# Altium project ALU_XOR_ONES.PrjPcb
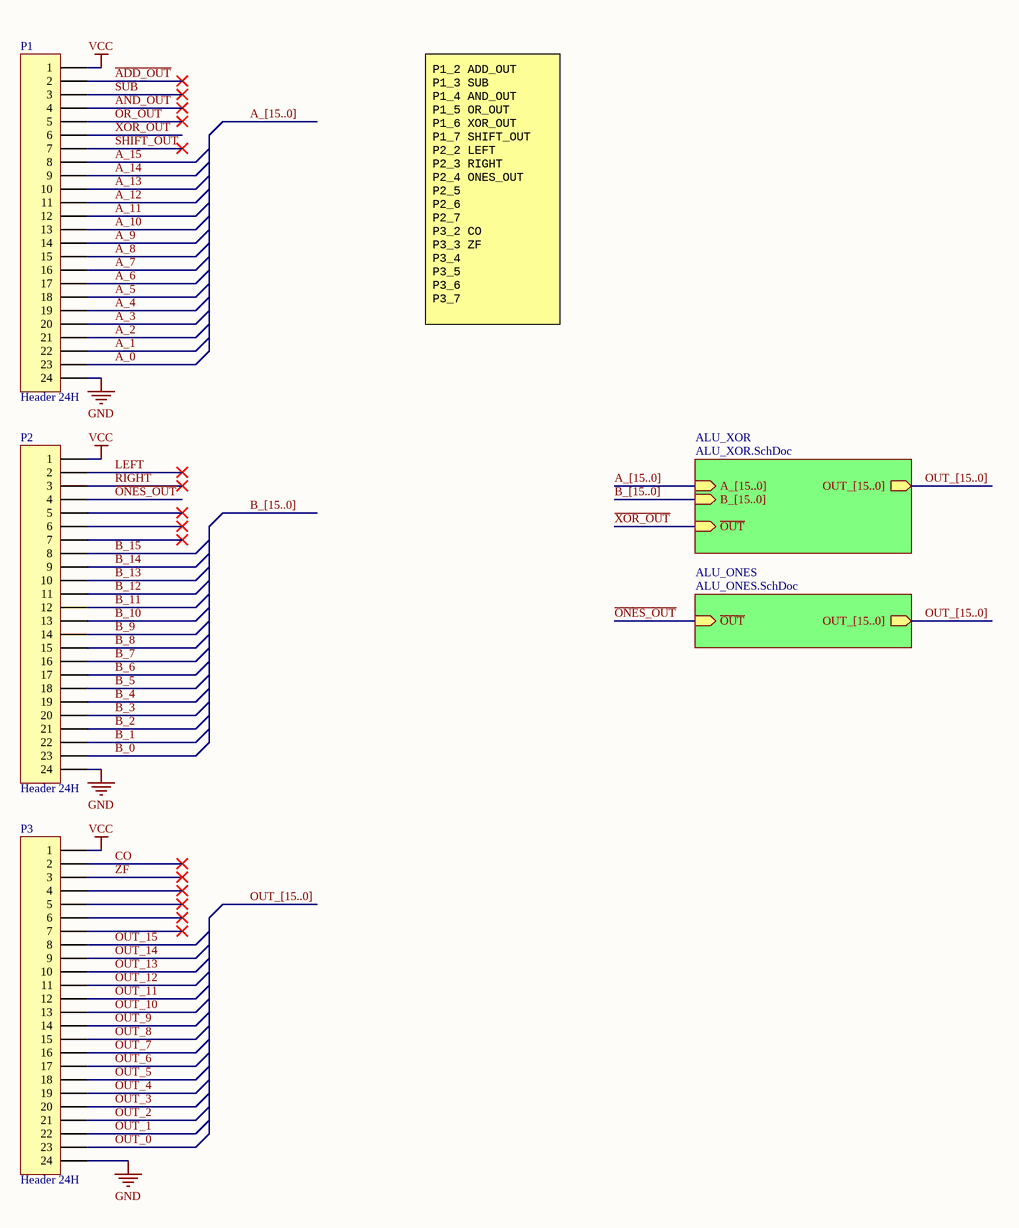
[diagram p0: Connectors.SchDoc]
3 sheets, 11 parts. Net scope: hierarchical (ports join the sheet entries above them; power ports are global).
Board file: ALU_XOR_ONES.PcbDoc
Sheets:
  Connectors.SchDoc
    ALU_XOR = ALU_XOR.SchDoc
    ALU_ONES = ALU_ONES.SchDoc

## Sheet Connectors.SchDoc
size B; Author: E. Sims; Organization: Let's Build Rockets Inc.; SheetNumber: 1; SheetTotal: 3

### Parts
P1  Header 24H  [HDR1X24H]
P2  Header 24H  [HDR1X24H]
P3  Header 24H  [HDR1X24H]

### Sub-sheets
ALU_ONES = ALU_ONES.SchDoc: ~{OUT} (in), OUT_[15..0] (out)
ALU_XOR = ALU_XOR.SchDoc: B_[15..0] (in), ~{OUT} (in), OUT_[15..0] (out), A_[15..0] (in)

### Nets
GND: P1.24 P2.24 P3.24
VCC: P1.1 P2.1 P3.1
~{ADD_OUT}: P1.2
~{AND_OUT}: P1.4
A_0: P1.23
A_1: P1.22
A_2: P1.21
A_3: P1.20
A_4: P1.19
A_5: P1.18
A_6: P1.17
A_7: P1.16
A_8: P1.15
A_9: P1.14
A_10: P1.13
A_11: P1.12
A_12: P1.11
A_13: P1.10
A_14: P1.9
A_15: P1.8
B_0: P2.23
B_1: P2.22
B_2: P2.21
B_3: P2.20
B_4: P2.19
B_5: P2.18
B_6: P2.17
B_7: P2.16
B_8: P2.15
B_9: P2.14
B_10: P2.13
B_11: P2.12
B_12: P2.11
B_13: P2.10
B_14: P2.9
B_15: P2.8
CO: P3.2
LEFT: P2.2
~{ONES_OUT}: P2.4 ; sheet ALU_ONES/~{OUT}
~{OR_OUT}: P1.5
OUT_0: P3.23
OUT_1: P3.22
OUT_2: P3.21
OUT_3: P3.20
OUT_4: P3.19
OUT_5: P3.18
OUT_6: P3.17
OUT_7: P3.16
OUT_8: P3.15
OUT_9: P3.14
OUT_10: P3.13
OUT_11: P3.12
OUT_12: P3.11
OUT_13: P3.10
OUT_14: P3.9
OUT_15: P3.8
RIGHT: P2.3
~{SHIFT_OUT}: P1.7
SUB: P1.3
~{XOR_OUT}: P1.6 ; sheet ALU_XOR/~{OUT}  [project net ~{OUT}]
~{ZF}: P3.3

Not connected (* = marked no-connect by the designer): P2 5* 6* 7*; P3 4* 5* 6* 7*

### Buses and harness runs
bus A_[15..0]
bus A_[15..0] = sheet ALU_XOR/A_[15..0]
bus B_[15..0]
bus B_[15..0] = sheet ALU_XOR/B_[15..0]
bus OUT_[15..0]
bus OUT_[15..0] = sheet ALU_ONES/OUT_[15..0]
bus OUT_[15..0] = sheet ALU_XOR/OUT_[15..0]

### Notes on the sheet
- P1_2 ADD_OUT
  P1_3 SUB
  P1_4 AND_OUT
  P1_5 OR_OUT
  P1_6 XOR_OUT
  P1_7 SHIFT_OUT
  P2_2 LEFT
  P2_3 RIGHT
  P2_4 ONES_OUT
  P2_5
  P2_6
  P2_7
  P3_2 CO
  P3_3 ZF
  P3_4
  P3_5
  P3_6
  P3_7
- Let's Build Rocket's Inc. Modular Paylaod System Based on TMP-010 Rev
  For more information visit https://github.com/LetsBuildRockets/Modular-Payload-System
  This work is licensed under CC BY-NC 4.0. To view a copy of this license, visit https://creativecommons.org/licenses/by-nc/4.0
- Title
- Size:
- Date:
- Assembly Variant:
- B
- Number:
- Time:
- Revision:
- Sheet
- of
- Author:
- File:

### Library data of the parts
P1-P3 = Header 24H: Header, 24-Pin, Right Angle; LatestRevisionDate: 17-Jul-2002; LatestRevisionNote: Re-released for DXP Platform.; Publisher: Altium Limited

## Sheet ALU_XOR.SchDoc
size B; Author: E. Sims; Organization: Let's Build Rockets Inc.; SheetNumber: 14; SheetTotal: 16
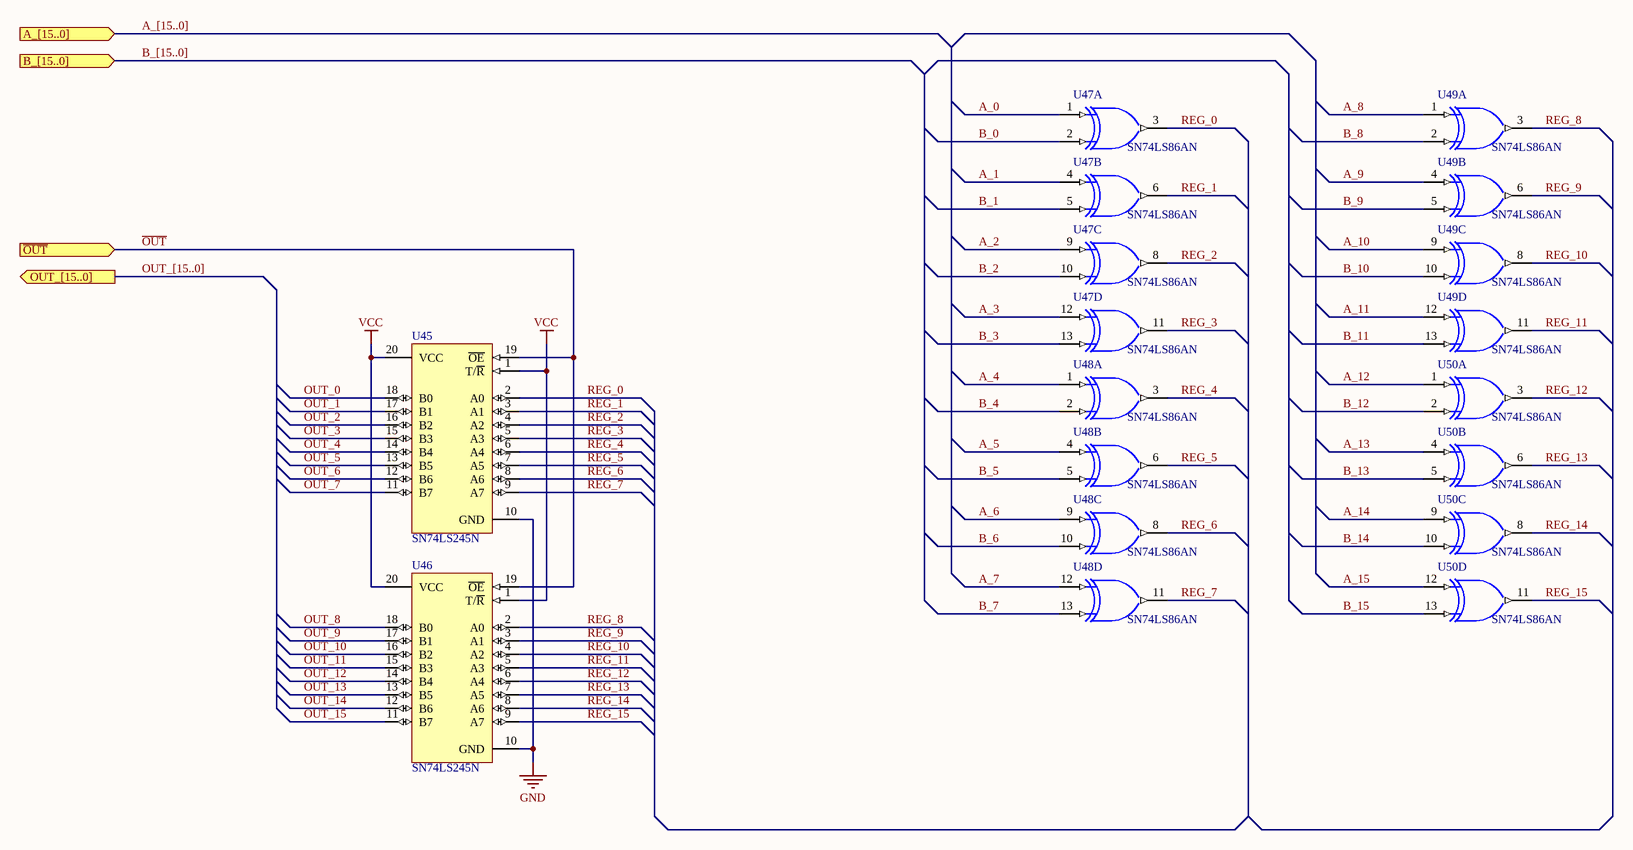
[diagram p1: ALU_XOR.SchDoc]

### Parts
U45  SN74LS245N  [N020]
U46  SN74LS245N  [N020]
U47  SN74LS86AN  [N014]  (parts A,B,C,D of 4)
U48  SN74LS86AN  [N014]  (parts A,B,C,D of 4)
U49  SN74LS86AN  [N014]  (parts A,B,C,D of 4)
U50  SN74LS86AN  [N014]  (parts A,B,C,D of 4)

### Ports
A_[15..0] (in), B_[15..0] (in), OUT_[15..0] (out), ~{OUT} (in)

### Nets
GND: U45.10(GND) U46.10(GND) U47.7(GND) U48.7(GND) U49.7(GND) U50.7(GND)
VCC: U45.1(T/~{R}) U45.20(VCC) U46.1(T/~{R}) U46.20(VCC) U47.14(VCC) U48.14(VCC) U49.14(VCC) U50.14(VCC)
A_0: U47.1(A)
A_1: U47.4(A)
A_2: U47.9(A)
A_3: U47.12(A)
A_4: U48.1(A)
A_5: U48.4(A)
A_6: U48.9(A)
A_7: U48.12(A)
A_8: U49.1(A)
A_9: U49.4(A)
A_10: U49.9(A)
A_11: U49.12(A)
A_12: U50.1(A)
A_13: U50.4(A)
A_14: U50.9(A)
A_15: U50.12(A)
B_0: U47.2(B)
B_1: U47.5(B)
B_2: U47.10(B)
B_3: U47.13(B)
B_4: U48.2(B)
B_5: U48.5(B)
B_6: U48.10(B)
B_7: U48.13(B)
B_8: U49.2(B)
B_9: U49.5(B)
B_10: U49.10(B)
B_11: U49.13(B)
B_12: U50.2(B)
B_13: U50.5(B)
B_14: U50.10(B)
B_15: U50.13(B)
~{OUT}: U45.19(~{OE}) U46.19(~{OE}) ; port ~{OUT}
OUT_0: U45.18(B0)
OUT_1: U45.17(B1)
OUT_2: U45.16(B2)
OUT_3: U45.15(B3)
OUT_4: U45.14(B4)
OUT_5: U45.13(B5)
OUT_6: U45.12(B6)
OUT_7: U45.11(B7)
OUT_8: U46.18(B0)
OUT_9: U46.17(B1)
OUT_10: U46.16(B2)
OUT_11: U46.15(B3)
OUT_12: U46.14(B4)
OUT_13: U46.13(B5)
OUT_14: U46.12(B6)
OUT_15: U46.11(B7)
REG_0: U45.2(A0) U47.3(Y)
REG_1: U45.3(A1) U47.6(Y)
REG_2: U45.4(A2) U47.8(Y)
REG_3: U45.5(A3) U47.11(Y)
REG_4: U45.6(A4) U48.3(Y)
REG_5: U45.7(A5) U48.6(Y)
REG_6: U45.8(A6) U48.8(Y)
REG_7: U45.9(A7) U48.11(Y)
REG_8: U46.2(A0) U49.3(Y)
REG_9: U46.3(A1) U49.6(Y)
REG_10: U46.4(A2) U49.8(Y)
REG_11: U46.5(A3) U49.11(Y)
REG_12: U46.6(A4) U50.3(Y)
REG_13: U46.7(A5) U50.6(Y)
REG_14: U46.8(A6) U50.8(Y)
REG_15: U46.9(A7) U50.11(Y)

### Buses and harness runs
bus A_[15..0] = port A_[15..0]
bus B_[15..0] = port B_[15..0]
bus OUT_[15..0] = port OUT_[15..0]

### Notes on the sheet
- Let's Build Rocket's Inc. Modular Paylaod System Based on TMP-010 Rev
  For more information visit https://github.com/LetsBuildRockets/Modular-Payload-System
  This work is licensed under CC BY-NC 4.0. To view a copy of this license, visit https://creativecommons.org/licenses/by-nc/4.0
- Title
- Size:
- Date:
- Assembly Variant:
- B
- Number:
- Time:
- Revision:
- Sheet
- of
- Author:
- File:

### Library data of the parts
U45 U46 = SN74LS245N: Octal Bus Transceiver with 3-State Outputs; Published: 8-Jun-2000; LatestRevisionDate: 04-Mar-2005; LatestRevisionNote: Stylized 3D Model Added.; DatasheetVersion: Mar-1988; PackageVersion: Oct-1995; PackageReference: N020; Publisher: Altium Limited; PackageDescription: DIP; 20 Leads; Row Spacing 7.62 mm; Pitch 2.54 mm; ComponentLink1Description: Manufacturer Link; ComponentLink1URL: http://www.ti.com/; ComponentLink2Description: Datasheet; ComponentLink2URL: http://www-s.ti.com/sc/ds/sn74ls245.pdf
U47-U50 = SN74LS86AN: Quadruple 2-Input Exclusive-OR Gate; Published: 8-Jun-2000; LatestRevisionDate: 04-Mar-2005; LatestRevisionNote: Stylized 3D Model Added.; DatasheetVersion: Mar-1988; PackageVersion: Oct-1995; PackageReference: N014; Publisher: Altium Limited; PackageDescription: DIP; 14 Leads; Row Spacing 7.62 mm; Pitch 2.54 mm; ComponentLink1Description: Manufacturer Link; ComponentLink1URL: http://www.ti.com/; ComponentLink2Description: Datasheet; ComponentLink2URL: http://www-s.ti.com/sc/ds/sn74ls86a.pdf

## Sheet ALU_ONES.SchDoc
size B; Author: E. Sims; Organization: Let's Build Rockets Inc.; SheetNumber: 17; SheetTotal: 17
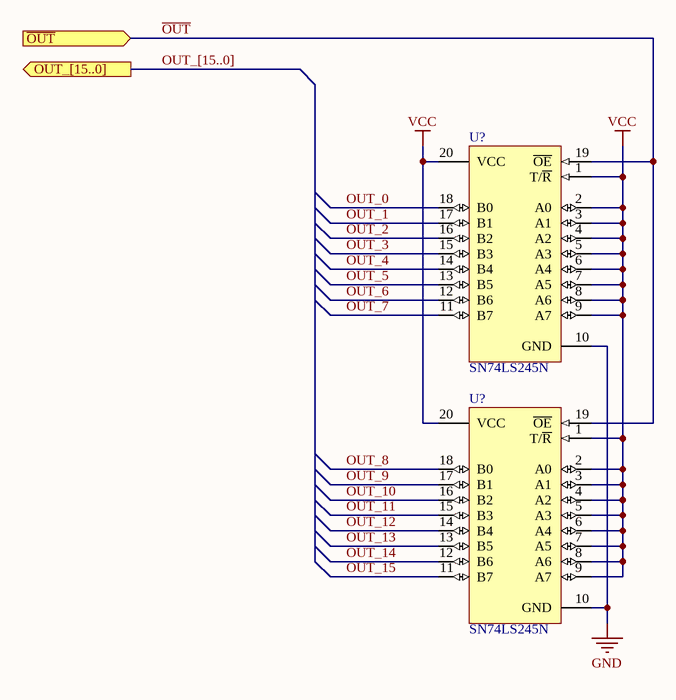
[diagram p2: ALU_ONES.SchDoc]

### Parts
(Parts that share a designator on the sheet are numbered #1, #2 ... from top to bottom, then left to right.)
U?#1  SN74LS245N  [N020]
U?#2  SN74LS245N  [N020]

### Ports
OUT_[15..0] (out), ~{OUT} (in)

### Nets
GND: U?#1.10(GND) U?#2.10(GND)
VCC: U?#1.1(T/~{R}) U?#1.2(A0) U?#1.3(A1) U?#1.4(A2) U?#1.5(A3) U?#1.6(A4) U?#1.7(A5) U?#1.8(A6) U?#1.9(A7) U?#1.20(VCC) U?#2.1(T/~{R}) U?#2.2(A0) U?#2.3(A1) U?#2.4(A2) U?#2.5(A3) U?#2.6(A4) U?#2.7(A5) U?#2.8(A6) U?#2.9(A7) U?#2.20(VCC)
~{OUT}: U?#1.19(~{OE}) U?#2.19(~{OE}) ; port ~{OUT}  [project net ~{ONES_OUT}]
OUT_0: U?#1.18(B0)
OUT_1: U?#1.17(B1)
OUT_2: U?#1.16(B2)
OUT_3: U?#1.15(B3)
OUT_4: U?#1.14(B4)
OUT_5: U?#1.13(B5)
OUT_6: U?#1.12(B6)
OUT_7: U?#1.11(B7)
OUT_8: U?#2.18(B0)
OUT_9: U?#2.17(B1)
OUT_10: U?#2.16(B2)
OUT_11: U?#2.15(B3)
OUT_12: U?#2.14(B4)
OUT_13: U?#2.13(B5)
OUT_14: U?#2.12(B6)
OUT_15: U?#2.11(B7)

### Buses and harness runs
bus OUT_[15..0] = port OUT_[15..0]

### Notes on the sheet
- Let's Build Rocket's Inc. Modular Paylaod System Based on TMP-010 Rev
  For more information visit https://github.com/LetsBuildRockets/Modular-Payload-System
  This work is licensed under CC BY-NC 4.0. To view a copy of this license, visit https://creativecommons.org/licenses/by-nc/4.0
- Title
- Size:
- Date:
- Assembly Variant:
- B
- Number:
- Time:
- Revision:
- Sheet
- of
- Author:
- File:

### Library data of the parts
U?#1 U?#2 = SN74LS245N: as U45 on sheet ALU_XOR; Published: 8-Jun-2000; LatestRevisionDate: 04-Mar-2005; LatestRevisionNote: Stylized 3D Model Added.; DatasheetVersion: Mar-1988; PackageVersion: Oct-1995; PackageReference: N020; Publisher: Altium Limited; PackageDescription: DIP; 20 Leads; Row Spacing 7.62 mm; Pitch 2.54 mm; ComponentLink1Description: Manufacturer Link; ComponentLink1URL: http://www.ti.com/; ComponentLink2Description: Datasheet; ComponentLink2URL: http://www-s.ti.com/sc/ds/sn74ls245.pdf

## Nets that join several sheets
GND: Connectors (P1.24 P2.24 P3.24), ALU_XOR (6 pins), ALU_ONES (U?#1.10 U?#2.10)
VCC: Connectors (P1.1 P2.1 P3.1), ALU_XOR (8 pins), ALU_ONES (20 pins)
A_0: Connectors (P1.23), ALU_XOR (U47.1)
A_1: Connectors (P1.22), ALU_XOR (U47.4)
A_2: Connectors (P1.21), ALU_XOR (U47.9)
A_3: Connectors (P1.20), ALU_XOR (U47.12)
A_4: Connectors (P1.19), ALU_XOR (U48.1)
A_5: Connectors (P1.18), ALU_XOR (U48.4)
A_6: Connectors (P1.17), ALU_XOR (U48.9)
A_7: Connectors (P1.16), ALU_XOR (U48.12)
A_8: Connectors (P1.15), ALU_XOR (U49.1)
A_9: Connectors (P1.14), ALU_XOR (U49.4)
A_10: Connectors (P1.13), ALU_XOR (U49.9)
A_11: Connectors (P1.12), ALU_XOR (U49.12)
A_12: Connectors (P1.11), ALU_XOR (U50.1)
A_13: Connectors (P1.10), ALU_XOR (U50.4)
A_14: Connectors (P1.9), ALU_XOR (U50.9)
A_15: Connectors (P1.8), ALU_XOR (U50.12)
B_0: Connectors (P2.23), ALU_XOR (U47.2)
B_1: Connectors (P2.22), ALU_XOR (U47.5)
B_2: Connectors (P2.21), ALU_XOR (U47.10)
B_3: Connectors (P2.20), ALU_XOR (U47.13)
B_4: Connectors (P2.19), ALU_XOR (U48.2)
B_5: Connectors (P2.18), ALU_XOR (U48.5)
B_6: Connectors (P2.17), ALU_XOR (U48.10)
B_7: Connectors (P2.16), ALU_XOR (U48.13)
B_8: Connectors (P2.15), ALU_XOR (U49.2)
B_9: Connectors (P2.14), ALU_XOR (U49.5)
B_10: Connectors (P2.13), ALU_XOR (U49.10)
B_11: Connectors (P2.12), ALU_XOR (U49.13)
B_12: Connectors (P2.11), ALU_XOR (U50.2)
B_13: Connectors (P2.10), ALU_XOR (U50.5)
B_14: Connectors (P2.9), ALU_XOR (U50.10)
B_15: Connectors (P2.8), ALU_XOR (U50.13)
~{ONES_OUT}: Connectors (P2.4), ALU_ONES (U?#1.19 U?#2.19)
~{OUT}: Connectors (P1.6), ALU_XOR (U45.19 U46.19)
OUT_0: Connectors (P3.23), ALU_XOR (U45.18), ALU_ONES (U?#1.18)
OUT_1: Connectors (P3.22), ALU_XOR (U45.17), ALU_ONES (U?#1.17)
OUT_2: Connectors (P3.21), ALU_XOR (U45.16), ALU_ONES (U?#1.16)
OUT_3: Connectors (P3.20), ALU_XOR (U45.15), ALU_ONES (U?#1.15)
OUT_4: Connectors (P3.19), ALU_XOR (U45.14), ALU_ONES (U?#1.14)
OUT_5: Connectors (P3.18), ALU_XOR (U45.13), ALU_ONES (U?#1.13)
OUT_6: Connectors (P3.17), ALU_XOR (U45.12), ALU_ONES (U?#1.12)
OUT_7: Connectors (P3.16), ALU_XOR (U45.11), ALU_ONES (U?#1.11)
OUT_8: Connectors (P3.15), ALU_XOR (U46.18), ALU_ONES (U?#2.18)
OUT_9: Connectors (P3.14), ALU_XOR (U46.17), ALU_ONES (U?#2.17)
OUT_10: Connectors (P3.13), ALU_XOR (U46.16), ALU_ONES (U?#2.16)
OUT_11: Connectors (P3.12), ALU_XOR (U46.15), ALU_ONES (U?#2.15)
OUT_12: Connectors (P3.11), ALU_XOR (U46.14), ALU_ONES (U?#2.14)
OUT_13: Connectors (P3.10), ALU_XOR (U46.13), ALU_ONES (U?#2.13)
OUT_14: Connectors (P3.9), ALU_XOR (U46.12), ALU_ONES (U?#2.12)
OUT_15: Connectors (P3.8), ALU_XOR (U46.11), ALU_ONES (U?#2.11)